# Altium schematic sheet BOC_LCD.SchDoc: Board-On-Chip LCD Display
size A; Organization: Altium Limited; Address1: L3, 12a Rodborough Rd; Address2: Frenchs Forest; Address3: NSW; Address4: Australia 2086; Revision: 1.06; SheetNumber: 10; SheetTotal: 16
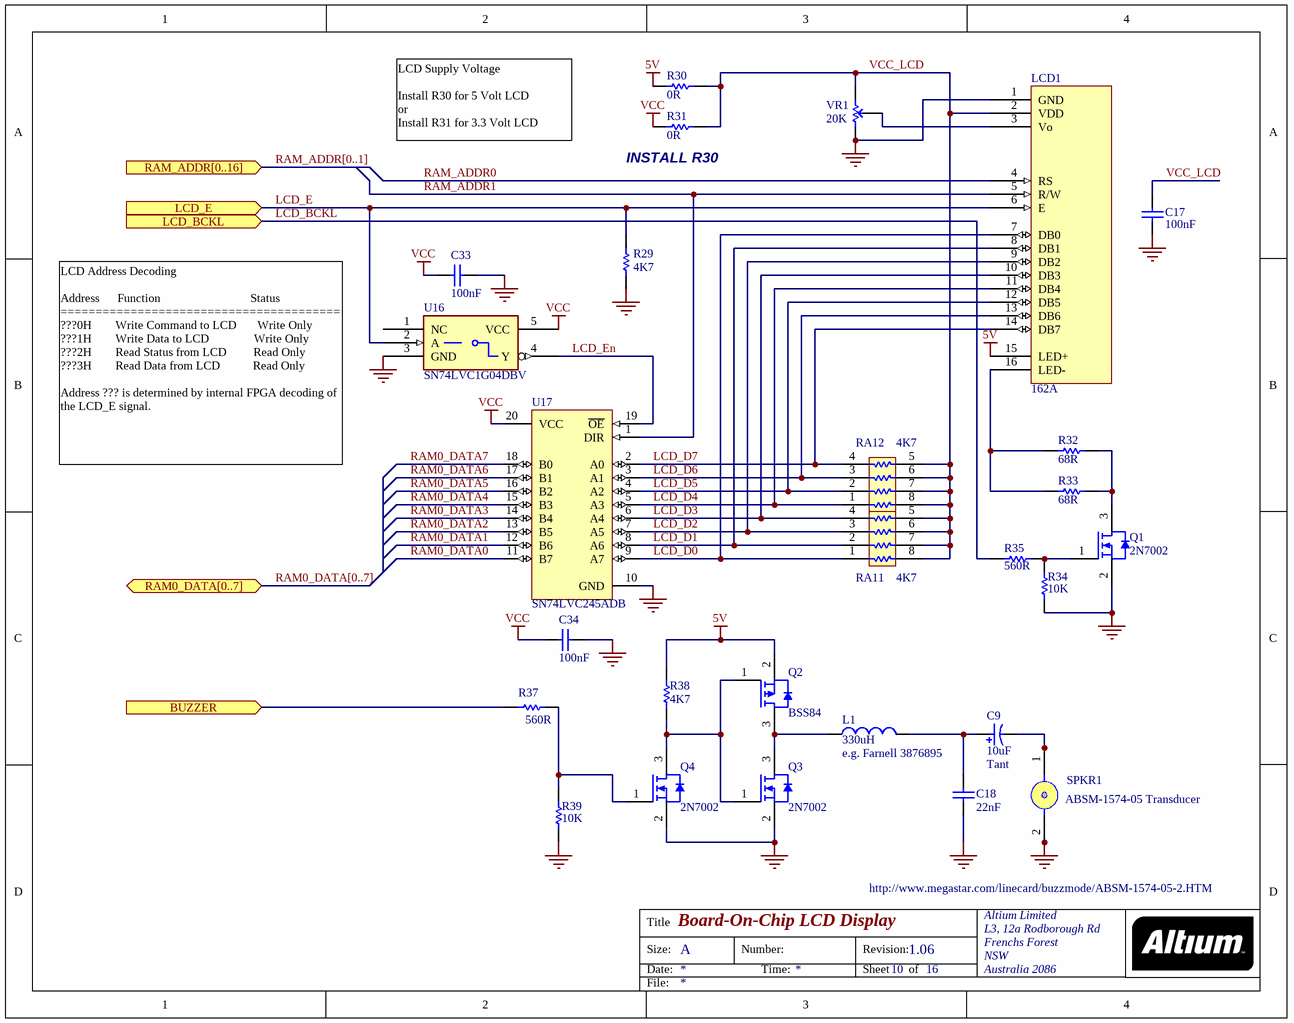
[diagram p0: BOC_LCD.SchDoc]

## Parts
C9  10uF  Capacitor Type: Tant  [MCCT-B]
C17  100nF  [CC2012-0805]
C18  22nF  [CC2012-0805]
C33  100nF  [CC2012-0805]
C34  100nF  [CC2012-0805]
L1  330uH  Part No: e.g. Farnell 3876895  [CC4532-1812]
LCD1  162A  [162A]
Q1  2N7002  [SO-G3]
Q2  BSS84  [SO-G3]
Q3  2N7002  [SO-G3]
Q4  2N7002  [SO-G3]
R29  4K7  [CC2012-0805]
R30  0R  [CC2012-0805]
R31  0R  [CC2012-0805]
R32  68R  [CC2012-0805]
R33  68R  [CC2012-0805]
R34  10K  [CC2012-0805]
R35  560R  [CC2012-0805]
R37  560R  [CC2012-0805]
R38  4K7  [CC2012-0805]
R39  10K  [CC2012-0805]
RA11  4K7  [MNR34]
RA12  4K7  [MNR34]
SPKR1  ABSM-1574-05 Transducer  [ABSM-1574]
U16  SN74LVC1G04DBV  [SO-G5/P.95]
U17  SN74LVC245ADB  [SSO-G20/P.65]
VR1  20K  [POT4MM-2]

## Ports
BUZZER (in), LCD_BCKL (in), LCD_E (in), RAM0_DATA[0..7] (bidir), RAM_ADDR[0..16] (in)

## Nets
5V: LCD1.15(LED+) Q2.2 R30.1 R38.1
GND: C17.2 C18.2 C33.2 C34.2 LCD1.1(GND) Q1.2 Q3.2 Q4.2 R29.2 R34.1 R39.2 SPKR1.2 SPKR1.2A U16.3(GND) U17.10(GND) VR1.CCW(-)
VCC: C33.1 C34.1 R31.1 U16.5(VCC) U17.20(VCC)
BUZZER: R37.1 ; port BUZZER
LCD_BCKL: R35.1 ; port LCD_BCKL
LCD_D0: LCD1.7(DB0) RA11.1 U17.9(A7)
LCD_D1: LCD1.8(DB1) RA11.2 U17.8(A6)
LCD_D2: LCD1.9(DB2) RA11.3 U17.7(A5)
LCD_D3: LCD1.10(DB3) RA11.4 U17.6(A4)
LCD_D4: LCD1.11(DB4) RA12.1 U17.5(A3)
LCD_D5: LCD1.12(DB5) RA12.2 U17.4(A2)
LCD_D6: LCD1.13(DB6) RA12.3 U17.3(A1)
LCD_D7: LCD1.14(DB7) RA12.4 U17.2(A0)
LCD_E: LCD1.6(E) R29.1 U16.2(A) ; port LCD_E
LCD_En: U16.4(Y) U17.19(~{OE})
RAM0_DATA0: U17.11(B7)
RAM0_DATA1: U17.12(B6)
RAM0_DATA2: U17.13(B5)
RAM0_DATA3: U17.14(B4)
RAM0_DATA4: U17.15(B3)
RAM0_DATA5: U17.16(B2)
RAM0_DATA6: U17.17(B1)
RAM0_DATA7: U17.18(B0)
RAM_ADDR0: LCD1.4(RS)
RAM_ADDR1: LCD1.5(R/W) U17.1(DIR)
VCC_LCD: C17.1 LCD1.2(VDD) R30.2 R31.2 RA11.5 RA11.6 RA11.7 RA11.8 RA12.5 RA12.6 RA12.7 RA12.8 VR1.CW(+)
NetC9_1: C9.1 C18.1 L1.2
NetC9_2: C9.2 SPKR1.1 SPKR1.1A
NetL1_1: L1.1 Q2.3 Q3.3
NetLCD1_3: LCD1.3(Vo) VR1.W
NetLCD1_16: LCD1.16(LED-) R32.1 R33.1
NetQ1_1: Q1.1 R34.2 R35.2
NetQ1_3: Q1.3 R32.2 R33.2
NetQ2_1: Q2.1 Q3.1 Q4.3 R38.2
NetQ4_1: Q4.1 R37.2 R39.1

Not connected (* = marked no-connect by the designer): U16 1(NC)

## Buses and harness runs
bus RAM0_DATA[0..7] = port RAM0_DATA[0..7]
bus RAM_ADDR[0..1] = port RAM_ADDR[0..16]

## Notes on the sheet
- LCD Supply Voltage
  Install R30 for 5 Volt LCD
  or
  Install R31 for 3.3 Volt LCD
- (near R31) INSTALL R30
- LCD Address Decoding
  Address      Function                              Status
  ========================================
  ???0H        Write Command to LCD       Write Only
  ???1H        Write Data to LCD               Write Only
  ???2H        Read Status from LCD         Read Only
  ???3H        Read Data from LCD           Read Only
  Address ??? is determined by internal FPGA decoding of the LCD_E signal.
- Title
- Size:
- Date:
- A
- Number:
- Time:
- Revision:
- Sheet
- of
- File:

## Library data of the parts
C9 = CAP_POLAR: Polar Capacitor; Fitted: True
C17 C18 C33 C34 = CAP: Capacitor; Fitted: True
L1 = INDUCTOR: Inductor e.g. Farnell 3876895; Fitted: True
LCD1 = 162A: 16 char * 2 line LCD character display with b/light; Fitted: True
Q1 Q3 Q4 = 2N7002: N Channel Mosfet; Fitted: True
Q2 = BSS84: P Channel Mosfet; Fitted: True
R29 R30 R32-R35 R37-R39 = RES: Resistor; Fitted: True
R31 = RES: Resistor; Fitted: False
RA11 RA12 = MNR34: 3216x4 Resistor Array; Fitted: True
SPKR1 = ABSM-1574-05 Transducer: Megastar Subminiature Transducer; Fitted: True; Web: http://www.megastar.com/linecard/buzzmode/ABSM-1574-05-2.HTM
U16 = SN74AHC1G04DBVR: Manufacturer: TI; Fitted: True
U17 = 74LVC245A: Octal Bus Transceiver with 3-State Outputs; Manufacturer: Texas Instruments; Revision 1: 12-July-2000: SIM Model Added.; Revision 2: July-2002: Re-released for DXP Platform.; Class I: Interface; Class II: Line Transceiver; Fitted: True; Published: 8-Jun-2000; Datasheet: Latest Revision: Oct-1993; Package Reference: J020; Publisher: Altium Limited
VR1 = POT_M: Potentiometer; Fitted: True